# Altium project ARTIX.PrjPcb
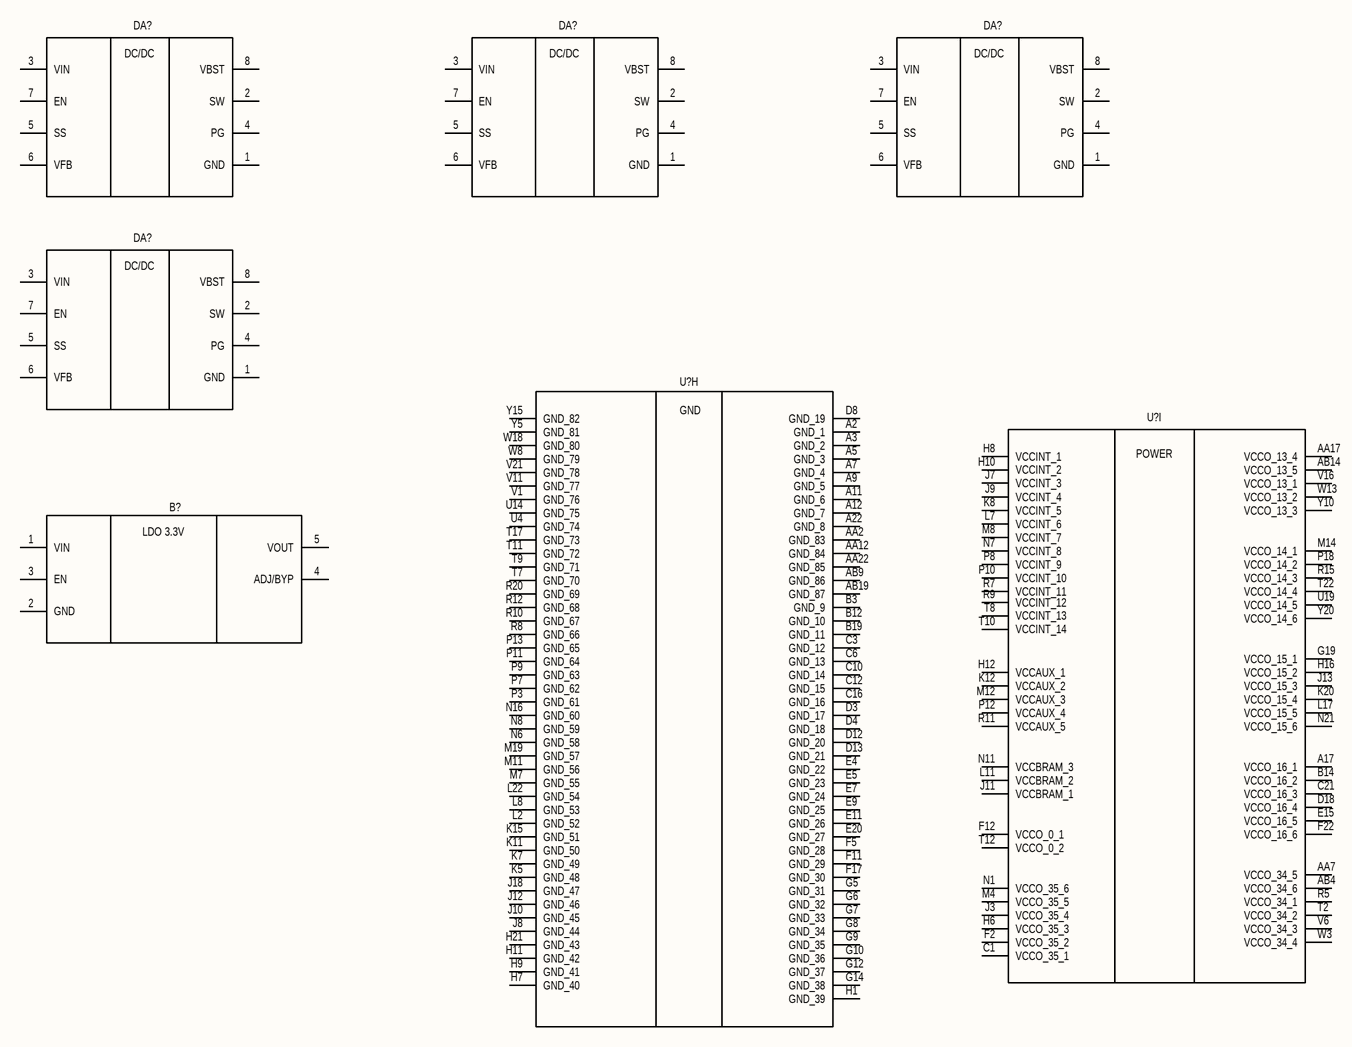
[diagram p0: 01_Power.SchDoc]
6 sheets, 41 parts. Net scope: global (net labels, ports and power ports of the same name join across sheets).
Sheets:
  01_Power.SchDoc
  02_FPGA_IO_Config.SchDoc
  03_FPGA_IO_Clock.SchDoc
  04_Reference_Inputs.SchDoc
  05_PPS_Outputs.SchDoc
  06_Ethernet.SchDoc

## Sheet 01_Power.SchDoc: Наименование
size 420 x 297 mm; Name: Наименование; ApprovedBy: Сергеева А.А.; CheckedBy: Рогозин А.А.; Author: Кузнецов М.Д.; CompanyName: МГТУ им. Баумана; DocumentNumber: 2; SheetNumber: 1; SheetTotal: 6; PageSetup: Record=PageOptions|CenterHorizontal=True|CenterVertical=True|PrintScale=0.94|XCorrection=1.00|YCorrection=1.00|PrintKind=1|BorderSize=5000000|LeftOffset=0|BottomOffset=0|Orientation=1|PaperLength=1000|PaperWidth=1000|Scale=100|PaperSource=7|PrintQuality=-4|MediaType=1|DitherType=10|PaperKind=A4|PrintScaleMode=1; DecimalNumber: МГТУ.468784.001; HeadOfSector: Нач. сектора; MainDevice: Перв.примен.; Name1: Плата расширения; n_kontr: Н. Контр; t_kontr: Т. Контр; lit_A: О; Name2: для отладочного модуля; DocumentName: Sheet1.SCHDOC

### Parts
(Parts that share a designator on the sheet are numbered #1, #2 ... from top to bottom, then left to right.)
B?#1  SPX3819M5-L-3-3  [SOT95P280X145-5N]  (value not drawn)
DA?#1  TPS563210A  [SOT65P280X110-8N]  (value not drawn)
DA?#2  TPS563210A  [SOT65P280X110-8N]  (value not drawn)
DA?#3  TPS563210A  [SOT65P280X110-8N]  (value not drawn)
DA?#4  TPS563210A  [SOT65P280X110-8N]  (value not drawn)
U?#1  XC7A50T-2FGG484I  [BGA484C100P22X22_2300X2300X260]  (value not drawn)  (part H of 10)
U?#2  XC7A50T-2FGG484I  [BGA484C100P22X22_2300X2300X260]  (value not drawn)  (part I of 10)

### Nets

Not connected (* = marked no-connect by the designer): B?#1 1(VIN) 2(GND) 3(EN) 4(ADJ/BYP) 5(VOUT); DA?#1 1(GND) 2(SW) 3(VIN) 4(PG) 5(SS) 6(VFB) 7(EN) 8(VBST); DA?#2 1(GND) 2(SW) 3(VIN) 4(PG) 5(SS) 6(VFB) 7(EN) 8(VBST); DA?#3 1(GND) 2(SW) 3(VIN) 4(PG) 5(SS) 6(VFB) 7(EN) 8(VBST); DA?#4 1(GND) 2(SW) 3(VIN) 4(PG) 5(SS) 6(VFB) 7(EN) 8(VBST); U?#1 A2(GND_1) A3(GND_2) A5(GND_3) A7(GND_4) A9(GND_5) A11(GND_6) A12(GND_7) A22(GND_8) AA2(GND_83) AA12(GND_84) AA22(GND_85) AB9(GND_86) AB19(GND_87) B3(GND_9) B12(GND_10) B19(GND_11) C3(GND_12) C6(GND_13) C10(GND_14) C12(GND_15) C16(GND_16) D3(GND_17) D4(GND_18) D8(GND_19) D12(GND_20) D13(GND_21) E4(GND_22) E5(GND_23) E7(GND_24) E9(GND_25) E11(GND_26) E20(GND_27) F5(GND_28) F11(GND_29) F17(GND_30) G5(GND_31) G6(GND_32) G7(GND_33) G8(GND_34) G9(GND_35) G10(GND_36) G12(GND_37) G14(GND_38) H1(GND_39) H7(GND_40) H9(GND_41) H11(GND_42) H21(GND_43) J8(GND_44) J10(GND_45) J12(GND_46) J18(GND_47) K5(GND_48) K7(GND_49) K11(GND_50) K15(GND_51) L2(GND_52) L8(GND_53) L22(GND_54) M7(GND_55) M11(GND_56) M19(GND_57) N6(GND_58) N8(GND_59) N16(GND_60) P3(GND_61) P7(GND_62) P9(GND_63) P11(GND_64) P13(GND_65) R8(GND_66) R10(GND_67) R12(GND_68) R20(GND_69) T7(GND_70) T9(GND_71) T11(GND_72) T17(GND_73) U4(GND_74) U14(GND_75) V1(GND_76) V11(GND_77) V21(GND_78) W8(GND_79) W18(GND_80) Y5(GND_81) Y15(GND_82); U?#2 A17(VCCO_16_1) AA7(VCCO_34_5) AA17(VCCO_13_4) AB4(VCCO_34_6) AB14(VCCO_13_5) B14(VCCO_16_2) C1(VCCO_35_1) C21(VCCO_16_3) D18(VCCO_16_4) E15(VCCO_16_5) F2(VCCO_35_2) F12(VCCO_0_1) F22(VCCO_16_6) G19(VCCO_15_1) H6(VCCO_35_3) H8(VCCINT_1) H10(VCCINT_2) H12(VCCAUX_1) H16(VCCO_15_2) J3(VCCO_35_4) J7(VCCINT_3) J9(VCCINT_4) J11(VCCBRAM_1) J13(VCCO_15_3) K8(VCCINT_5) K12(VCCAUX_2) K20(VCCO_15_4) L7(VCCINT_6) L11(VCCBRAM_2) L17(VCCO_15_5) M4(VCCO_35_5) M8(VCCINT_7) M12(VCCAUX_3) M14(VCCO_14_1) N1(VCCO_35_6) N7(VCCINT_8) N11(VCCBRAM_3) N21(VCCO_15_6) P8(VCCINT_9) P10(VCCINT_10) P12(VCCAUX_4) P18(VCCO_14_2) R5(VCCO_34_1) R7(VCCINT_11) R9(VCCINT_12) R11(VCCAUX_5) R15(VCCO_14_3) T2(VCCO_34_2) T8(VCCINT_13) T10(VCCINT_14) T12(VCCO_0_2) T22(VCCO_14_4) U19(VCCO_14_5) V6(VCCO_34_3) V16(VCCO_13_1) W3(VCCO_34_4) W13(VCCO_13_2) Y10(VCCO_13_3) Y20(VCCO_14_6)

### Notes on the sheet
- Перв.примен.
- Справ.№
- Подп. и дата
- Инв.№ дубл.
- Взам.инв.№
- Подп.и дата
- Разраб.
- Изм.
- Лист
- № докум.
- Подп.
- Дата
- Лит.
- Масштаб
- Масса
- Т.контр.
- Пров.
- СХЕМА   ЭЛЕКТРИЧЕСКАЯ
- ПРИНЦИПИАЛЬНАЯ
- Листов
- Инв.№ подл.
- Утв.
- Н.контр.
- Нач.сект.
- Формат  A3
- (in symbol SPX3819M5-L-3-3) LDO 3.3V
- (in symbol TPS563210A) DC/DC
- (in symbol XC7A50T-2FGG484I, part H) GND
- (in symbol XC7A50T-2FGG484I, part I) POWER

### Library data of the parts
B?#1 = SPX3819M5-L-3-3: IC REG LINEAR 3.3V 500MA SOT23-5; Manufacturer_Name: MaxLinear, Inc.; Geometry.Height: 1.45mm; Manufacturer_Part_Number: SPX3819M5-L-3-3; Mouser Part Number: 701-SPX3819M5-L-3-3; Mouser Price/Stock: https://www.mouser.co.uk/ProductDetail/MaxLinear/SPX3819M5-L-3-3?qs=2Z08r0Wtf%2Fyl32mFDRYBCg%3D%3D; Arrow Part Number: *; Arrow Price/Stock: *; Datasheet Link: https://componentsearchengine.com/Datasheets/2/SPX3819M5-L-3-3.pdf
DA?#1-DA?#4 = TPS563210A: Texas Instruments TPS563210A synchronous buck regulator, DDF 8-pin; custom GOST-style schematic symbol; OrderingSuffix: DDFR/DDFT packaging not selected; Manufacturer: Texas Instruments; MPN: TPS563210A; Package: DDF; Datasheet: https://www.ti.com/lit/ds/symlink/tps563210a.pdf; Source: TI datasheet pin functions page 3; user-requested native symbol
U?#1 U?#2 = XC7A50T-2FGG484I: FPGA - Field Programmable Gate Array XC7A50T-2FGG484I; Manufacturer_Name: AMD; Geometry.Height: 2.6mm; Manufacturer_Part_Number: XC7A50T-2FGG484I; Mouser Part Number: 217-XC7A50T-2FGG484I; Mouser Price/Stock: https://www.mouser.co.uk/ProductDetail/Xilinx/XC7A50T-2FGG484I?qs=rrS6PyfT74djoRso%252BOe%2F9Q%3D%3D; Arrow Part Number: *; Arrow Price/Stock: *; Datasheet Link: https://www.xilinx.com/support/documentation/data_sheets/ds181_Artix_7_Data_Sheet.pdf

## Sheet 02_FPGA_IO_Config.SchDoc: Наименование
size 420 x 297 mm; Name: Наименование; ApprovedBy: Сергеева А.А.; CheckedBy: Рогозин А.А.; Author: Кузнецов М.Д.; CompanyName: МГТУ им. Баумана; DocumentNumber: 3; SheetNumber: 2; SheetTotal: 6; PageSetup: Record=PageOptions|CenterHorizontal=True|CenterVertical=True|PrintScale=0.94|XCorrection=1.00|YCorrection=1.00|PrintKind=1|BorderSize=5000000|LeftOffset=0|BottomOffset=0|Orientation=1|PaperLength=1000|PaperWidth=1000|Scale=100|PaperSource=7|PrintQuality=-4|MediaType=1|DitherType=10|PaperKind=A4|PrintScaleMode=1; DecimalNumber: МГТУ.468784.001; HeadOfSector: Нач. сектора; MainDevice: Перв.примен.; Name1: Плата расширения; n_kontr: Н. Контр; t_kontr: Т. Контр; lit_A: О; Name2: для отладочного модуля; DocumentName: Sheet1.SCHDOC
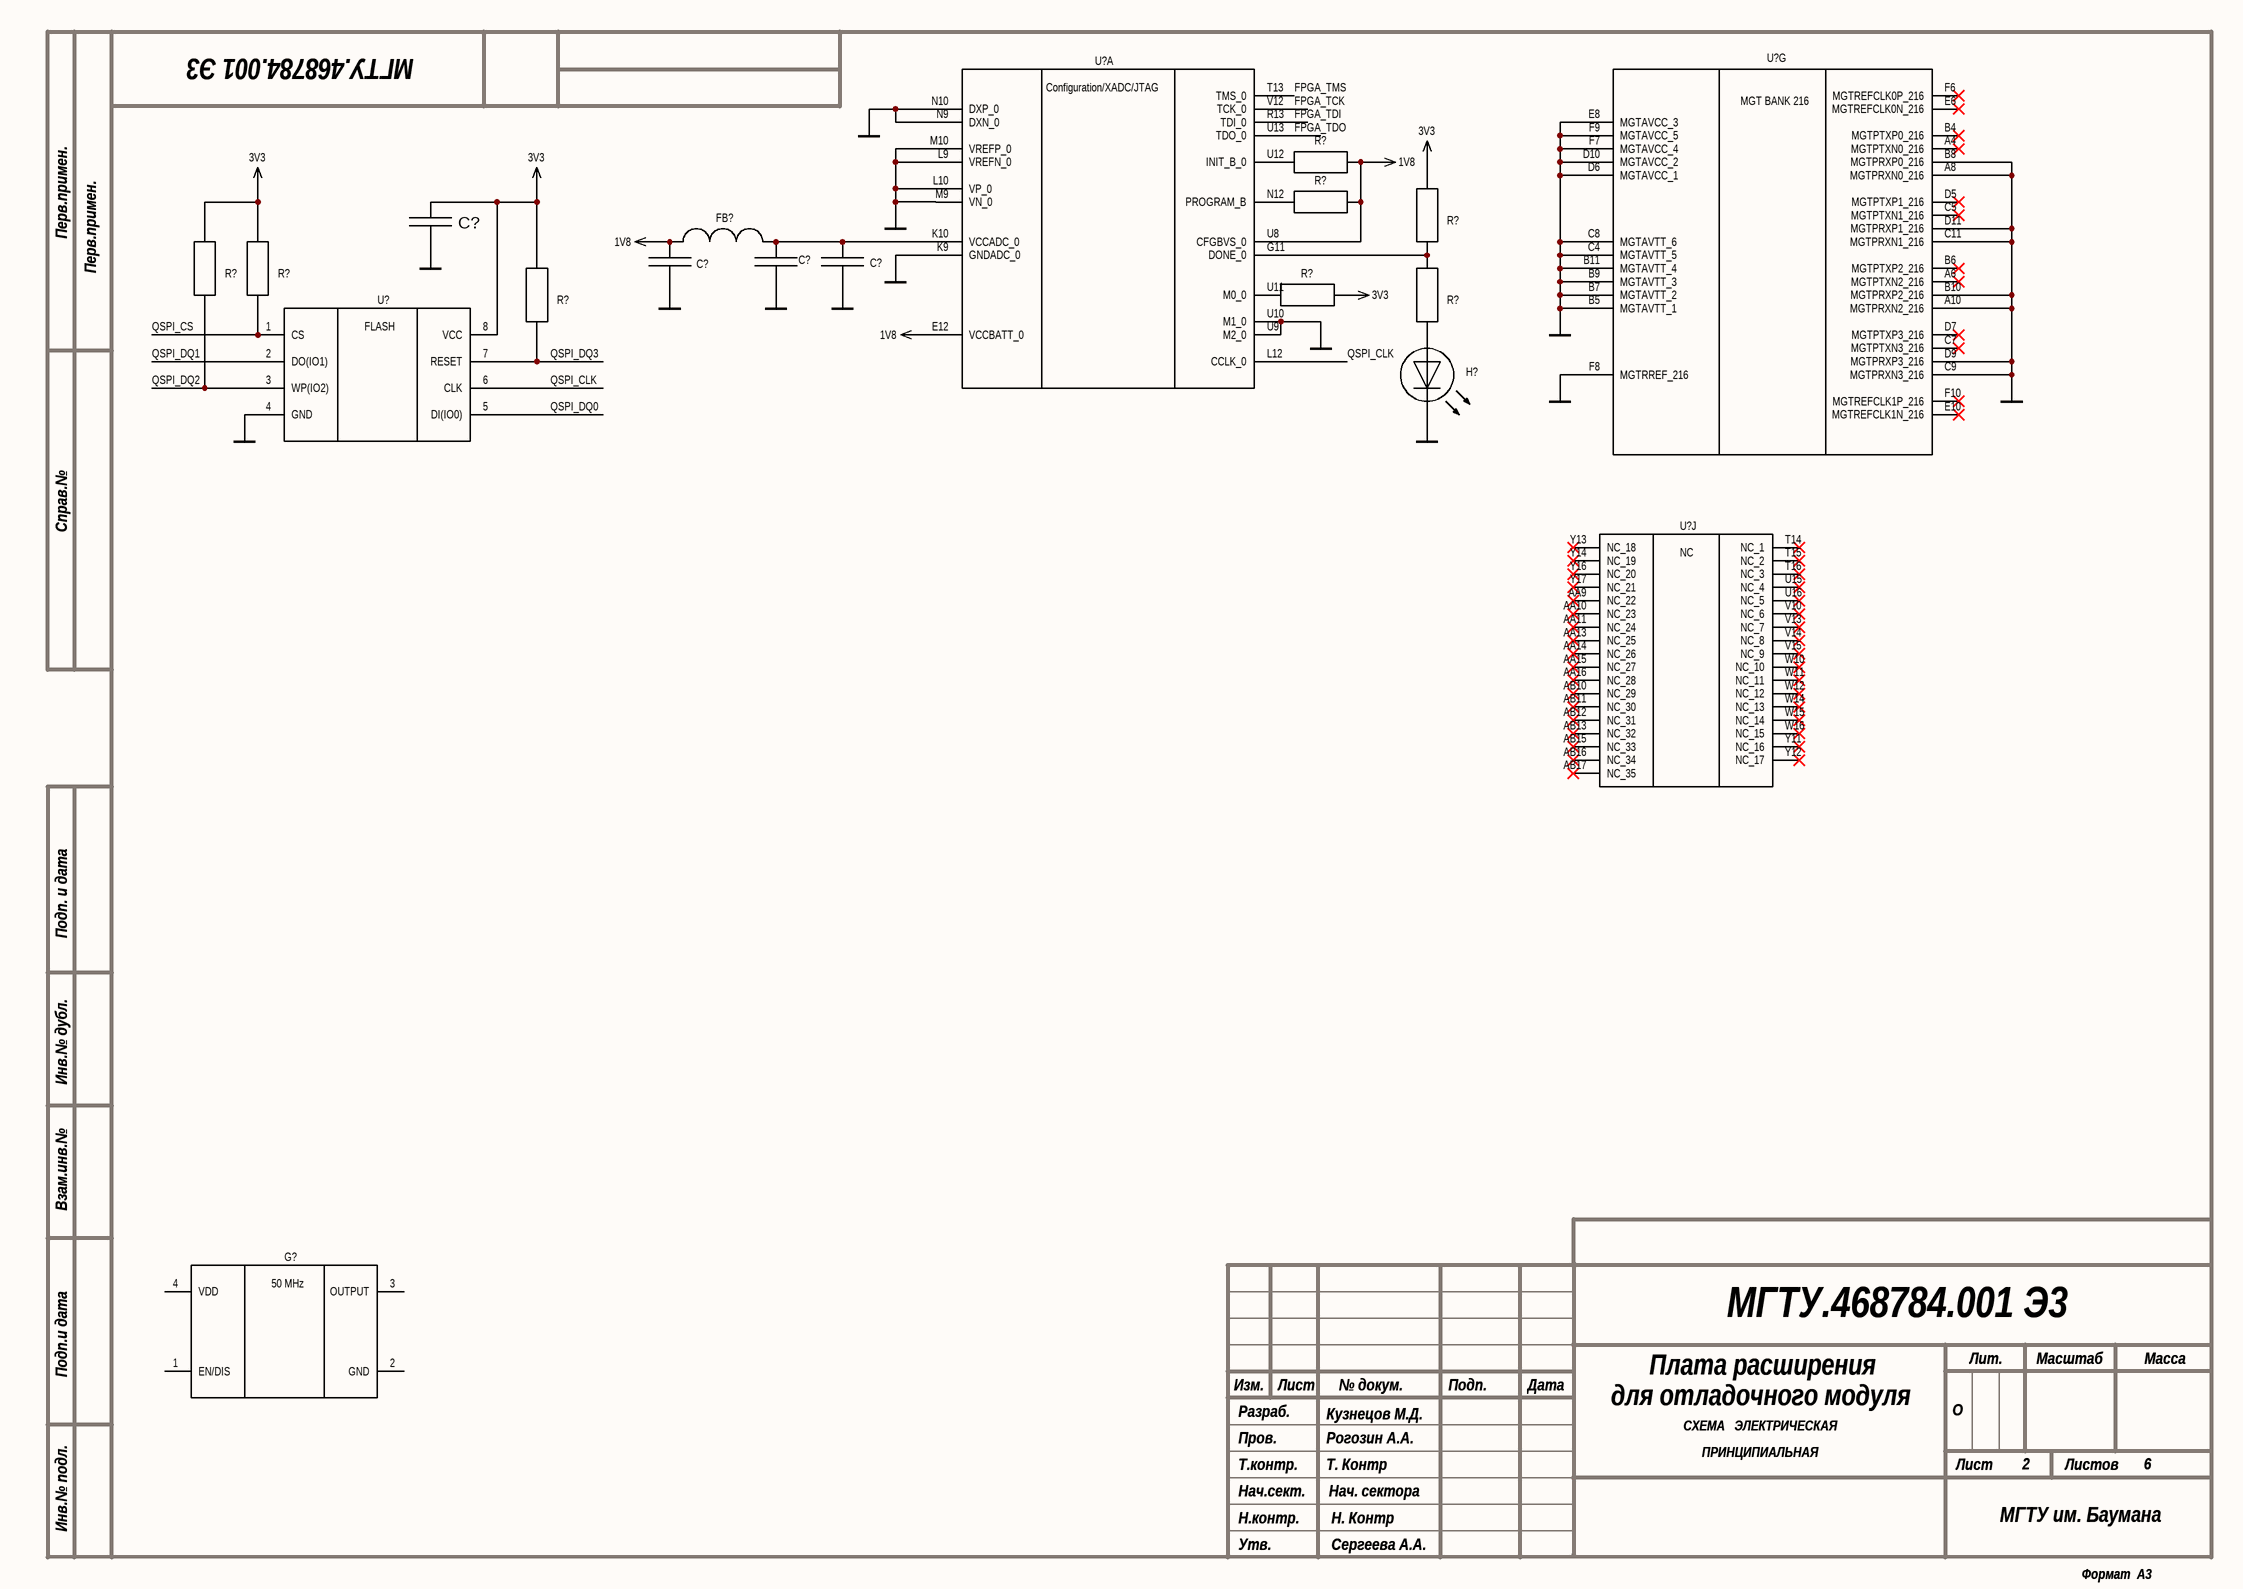
[diagram p1: 02_FPGA_IO_Config.SchDoc]

### Parts
(Parts that share a designator on the sheet are numbered #1, #2 ... from top to bottom, then left to right.)
C?#1  C  [C_0603]  (value not drawn)
C?#2  C  [C_1206]  (value not drawn)
C?#3  C  [C_0805]  (value not drawn)
C?#4  C  [C_0603]  (value not drawn)
FB?  BLM18SG121TN1D  [FP-BLM18-0_15-t0_5-d1_2-IPC_B]  (value not drawn)
G?#1  ASV-50.000MHZ-LRS-T  [ASV25000MHZEJT]  (value not drawn)
H?  LED  [PLCC2]  (value not drawn)
R?#1  R  [R_1206]  (value not drawn)
R?#2  R  [R_1206]  (value not drawn)
R?#3  R  [R_1206]  (value not drawn)
R?#4  R  [R_1206]  (value not drawn)
R?#5  R  [R_1206]  (value not drawn)
R?#6  R  [R_0603]  (value not drawn)
R?#7  R  [R_0603]  (value not drawn)
R?#8  R  [R_0603]  (value not drawn)
U?#3  XC7A50T-2FGG484I  [BGA484C100P22X22_2300X2300X260]  (value not drawn)  (part A of 10)
U?#4  XC7A50T-2FGG484I  [BGA484C100P22X22_2300X2300X260]  (value not drawn)  (part G of 10)
U?#5  W25Q128JVSIQ  [SOIC127P790X216-8N]  (value not drawn)
U?#6  XC7A50T-2FGG484I  [BGA484C100P22X22_2300X2300X260]  (value not drawn)  (part J of 10)

### Nets
1V8: C?#3.2 FB?.1 R?#1.2 R?#2.2 U?#3.E12(VCCBATT_0) U?#3.U8(CFGBVS_0)
3V3: C?#1.2 R?#3.1 R?#4.1 R?#5.1 R?#6.2 R?#7.2 U?#5.8(VCC)
GND: C?#1.1 C?#2.2 C?#3.1 C?#4.1 H?.2(C) U?#3.K9(GNDADC_0) U?#3.L9(VREFN_0) U?#3.L10(VP_0) U?#3.M9(VN_0) U?#3.M10(VREFP_0) U?#3.N9(DXN_0) U?#3.N10(DXP_0) U?#3.U9(M2_0) U?#3.U10(M1_0) U?#4.A8(MGTPRXN0_216) U?#4.A10(MGTPRXN2_216) U?#4.B5(MGTAVTT_1) U?#4.B7(MGTAVTT_2) U?#4.B8(MGTPRXP0_216) U?#4.B9(MGTAVTT_3) U?#4.B10(MGTPRXP2_216) U?#4.B11(MGTAVTT_4) U?#4.C4(MGTAVTT_5) U?#4.C8(MGTAVTT_6) U?#4.C9(MGTPRXN3_216) U?#4.C11(MGTPRXN1_216) U?#4.D6(MGTAVCC_1) U?#4.D9(MGTPRXP3_216) U?#4.D10(MGTAVCC_2) U?#4.D11(MGTPRXP1_216) U?#4.E8(MGTAVCC_3) U?#4.F7(MGTAVCC_4) U?#4.F8(MGTRREF_216) U?#4.F9(MGTAVCC_5) U?#5.4(GND)
FPGA_TCK: U?#3.V12(TCK_0)
FPGA_TDI: U?#3.R13(TDI_0)
FPGA_TDO: U?#3.U13(TDO_0)
FPGA_TMS: U?#3.T13(TMS_0)
QSPI_CLK: U?#3.L12(CCLK_0) U?#5.6(CLK)
QSPI_CS: R?#4.2 U?#5.1(CS)
QSPI_DQ0: U?#5.5(DI(IO0))
QSPI_DQ1: U?#5.2(DO(IO1))
QSPI_DQ2: R?#3.2 U?#5.3(WP(IO2))
QSPI_DQ3: R?#5.2 U?#5.7(RESET)
NetC?#2_1: C?#2.1 C?#4.2 FB?.2 U?#3.K10(VCCADC_0)
NetH?_1: H?.1(A) R?#8.1
NetR?#1_1: R?#1.1 U?#3.U12(INIT_B_0)
NetR?#2_1: R?#2.1 U?#3.N12(PROGRAM_B)
NetR?#6_1: R?#6.1 R?#8.2 U?#3.G11(DONE_0)
NetR?#7_1: R?#7.1 U?#3.U11(M0_0)

Not connected (* = marked no-connect by the designer): G?#1 1(EN/DIS) 2(GND) 3(OUTPUT) 4(VDD); U?#4 A4(MGTPTXN0_216)* A6(MGTPTXN2_216)* B4(MGTPTXP0_216)* B6(MGTPTXP2_216)* C5(MGTPTXN1_216)* C7(MGTPTXN3_216)* D5(MGTPTXP1_216)* D7(MGTPTXP3_216)* E6(MGTREFCLK0N_216)* E10(MGTREFCLK1N_216)* F6(MGTREFCLK0P_216)* F10(MGTREFCLK1P_216)*; U?#6 AA9(NC_22)* AA10(NC_23)* AA11(NC_24)* AA13(NC_25)* AA14(NC_26)* AA15(NC_27)* AA16(NC_28)* AB10(NC_29)* AB11(NC_30)* AB12(NC_31)* AB13(NC_32)* AB15(NC_33)* AB16(NC_34)* AB17(NC_35)* T14(NC_1)* T15(NC_2)* T16(NC_3)* U15(NC_4)* U16(NC_5)* V10(NC_6)* V13(NC_7)* V14(NC_8)* V15(NC_9)* W10(NC_10)* W11(NC_11)* W12(NC_12)* W14(NC_13)* W15(NC_14)* W16(NC_15)* Y11(NC_16)* Y12(NC_17)* Y13(NC_18)* Y14(NC_19)* Y16(NC_20)* Y17(NC_21)*

### Notes on the sheet
- Перв.примен.
- Справ.№
- Подп. и дата
- Инв.№ дубл.
- Взам.инв.№
- Подп.и дата
- Разраб.
- Изм.
- Лист
- № докум.
- Подп.
- Дата
- Лит.
- Масштаб
- Масса
- Т.контр.
- Пров.
- СХЕМА   ЭЛЕКТРИЧЕСКАЯ
- ПРИНЦИПИАЛЬНАЯ
- Листов
- Инв.№ подл.
- Утв.
- Н.контр.
- Нач.сект.
- Формат  A3
- (in symbol ASV-50.000MHZ-LRS-T) 50 MHz
- (in symbol W25Q128JVSIQ) FLASH
- (in symbol XC7A50T-2FGG484I, part A) Configuration/XADC/JTAG
- (in symbol XC7A50T-2FGG484I, part G) MGT BANK 216
- (in symbol XC7A50T-2FGG484I, part J) NC

### Library data of the parts
C?#1 C?#4 = Конденсатор GRM188R71C104K (0.10 мкФ +-10% X7R 16В): Capacitance: 0u1; Tolerance: ±10%; Dielectric Type: X7R; Maximum Voltage: 16V; Part Number: Конденсатор GRM188R71C104K (0.10 мкФ +-10% X7R 16В); HelpURL: http://search.murata.co.jp/Ceramy/image/img/A01X/G101/ENG/GRM188R71C104KA01-01.pdf
C?#2 = Конденсатор GRM31CR71H475K (4.7 мкФ +-10% X7R 50В): Capacitance: 4u7; Tolerance: ±10%; Dielectric Type: X7R; Maximum Voltage: 50V; Part Number: Конденсатор GRM31CR71H475K (4.7 мкФ +-10% X7R 50В); HelpURL: http://search.murata.co.jp/Ceramy/image/img/A01X/G101/ENG/GRM31CR71H475KA12-01.pdf
C?#3 = Конденсатор GRM21BR71C105K (1.0 мкФ +-10% X7R 16В): Capacitance: 1u; Tolerance: ±10%; Dielectric Type: X7R; Maximum Voltage: 16V; Part Number: Конденсатор GRM21BR71C105K (1.0 мкФ +-10% X7R 16В); HelpURL: http://search.murata.co.jp/Ceramy/image/img/A01X/G101/ENG/GRM21BR71C105KA01-01.pdf
FB? = CMP-0686-00602-4: Chip Ferrite Bead, 0603, 120Ω @ 100MHz, 25%, 0.025Ω, 3A; DC Resistance (DCR): 25mR; Shielding: Unshielded; Material: Steel; Number of Circuits: 1; Impedance: 120R; Tolerance: 25%; REACH SVHC: No SVHC; Case/Package: 0603; Max DC Current: 3A; Core Material: Ferrite; Case Code (Metric): 1608; Frequency: 100MHz; Package Quantity: 1; Height: 0.8mm; Lead Free: Lead Free; Test Frequency: 100MHz; RoHS Compliant: Yes; DC Resistance-Max: 25mR; Min Operating Temperature: -55°C; Width: 0.8mm; Termination: SMD/SMT; Length: 1.6mm; Max Current Rating: 3A; Number of Lines: 1; Series: BLM18S; Number of Pins: 2; Packaging: Tape and Reel; Current Rating: 3A; Depth: 0.8mm; Case Code (Imperial): 0603; Max Operating Temperature: 125°C
G?#1 = ASV-50.000MHZ-LRS-T: Crystal or Oscillator; Manufacturer_Name: ABRACON; Datasheet Link: https://abracon.com/Oscillators/ASV.pdf; Height: 1.8mm; Manufacturer_Part_Number: ASV-50.000MHZ-LRS-T; Mouser Part Number: 815-ASV50000MHZLRST; Mouser Price/Stock: https://www.mouser.co.uk/ProductDetail/ABRACON/ASV-50.000MHZ-LRS-T?qs=vmHwEFxEFR%252BcE99Zr2GZkQ%3D%3D
H? = Светодиод CLM1B-RKW: Part Number: Светодиод CLM1B-RKW; HelpURL: http://www.cree.com/~/media/Files/Cree/LED-Components-and-Modules/HB/Data-Sheets/CLM1BRKWAKW1084.pdf; Color: Red
R?#1-R?#5 = Резистор RC1206JR-074K7L (4.7 кОм +-5%): Resistance: 4k7; Tolerance: ±5%; Power: 0.25 W; Maximum Working Voltage: 200V; Maximum Overload Voltage: 400V; Part Number: Резистор RC1206JR-074K7L (4.7 кОм +-5%); HelpURL: http://www.yageo.ru/pdf/RC1206.pdf
R?#6 R?#8 = Резистор RC0603JR-07240RL (240 Ом +-5%): Resistance: 240; Tolerance: ±5%; Power: 0.1 W; Maximum Working Voltage: 50V; Maximum Overload Voltage: 100V; Part Number: Резистор RC0603JR-07240RL (240 Ом +-5%); HelpURL: http://www.yageo.ru/pdf/RC0603.pdf
R?#7 = Резистор RC0603JR-0711KL (11 кОм +-5%): Resistance: 11k; Tolerance: ±5%; Power: 0.1 W; Maximum Working Voltage: 50V; Maximum Overload Voltage: 100V; Part Number: Резистор RC0603JR-0711KL (11 кОм +-5%); HelpURL: http://www.yageo.ru/pdf/RC0603.pdf
U?#3 U?#4 U?#6 = XC7A50T-2FGG484I: as U?#1 on sheet 01_Power; Manufacturer_Part_Number: XC7A50T-2FGG484I; Mouser Part Number: 217-XC7A50T-2FGG484I; Mouser Price/Stock: https://www.mouser.co.uk/ProductDetail/Xilinx/XC7A50T-2FGG484I?qs=rrS6PyfT74djoRso%252BOe%2F9Q%3D%3D; Arrow Part Number: *; Arrow Price/Stock: *; Datasheet Link: https://www.xilinx.com/support/documentation/data_sheets/ds181_Artix_7_Data_Sheet.pdf
U?#5 = W25Q128JVSIQ: FLASH - NOR Memory IC 128Mb (16M x 8) SPI - Quad I/O, QPI, DTR 133 MHz 8-SOIC; MF: Winbond Electronics; SnapEDA_Link: https://www.snapeda.com/parts/W25Q128JVSIQ/Winbond/view-part/?ref=snap; Package: SOIC-8 Winbond Electronics; Value: *; MP: W25Q128JVSIQ; Check_prices: https://www.snapeda.com/parts/W25Q128JVSIQ/Winbond/view-part/?ref=eda

## Sheet 03_FPGA_IO_Clock.SchDoc: Наименование
size 420 x 297 mm; Name: Наименование; ApprovedBy: Сергеева А.А.; CheckedBy: Рогозин А.А.; Author: Кузнецов М.Д.; CompanyName: МГТУ им. Баумана; DocumentNumber: 4; SheetNumber: 3; SheetTotal: 6; PageSetup: Record=PageOptions|CenterHorizontal=True|CenterVertical=True|PrintScale=0.94|XCorrection=1.00|YCorrection=1.00|PrintKind=1|BorderSize=5000000|LeftOffset=0|BottomOffset=0|Orientation=1|PaperLength=1000|PaperWidth=1000|Scale=100|PaperSource=7|PrintQuality=-4|MediaType=1|DitherType=10|PaperKind=A4|PrintScaleMode=1; DecimalNumber: МГТУ.468784.001; HeadOfSector: Нач. сектора; MainDevice: Перв.примен.; Name1: Плата расширения; n_kontr: Н. Контр; t_kontr: Т. Контр; lit_A: О; Name2: для отладочного модуля; DocumentName: Sheet1.SCHDOC
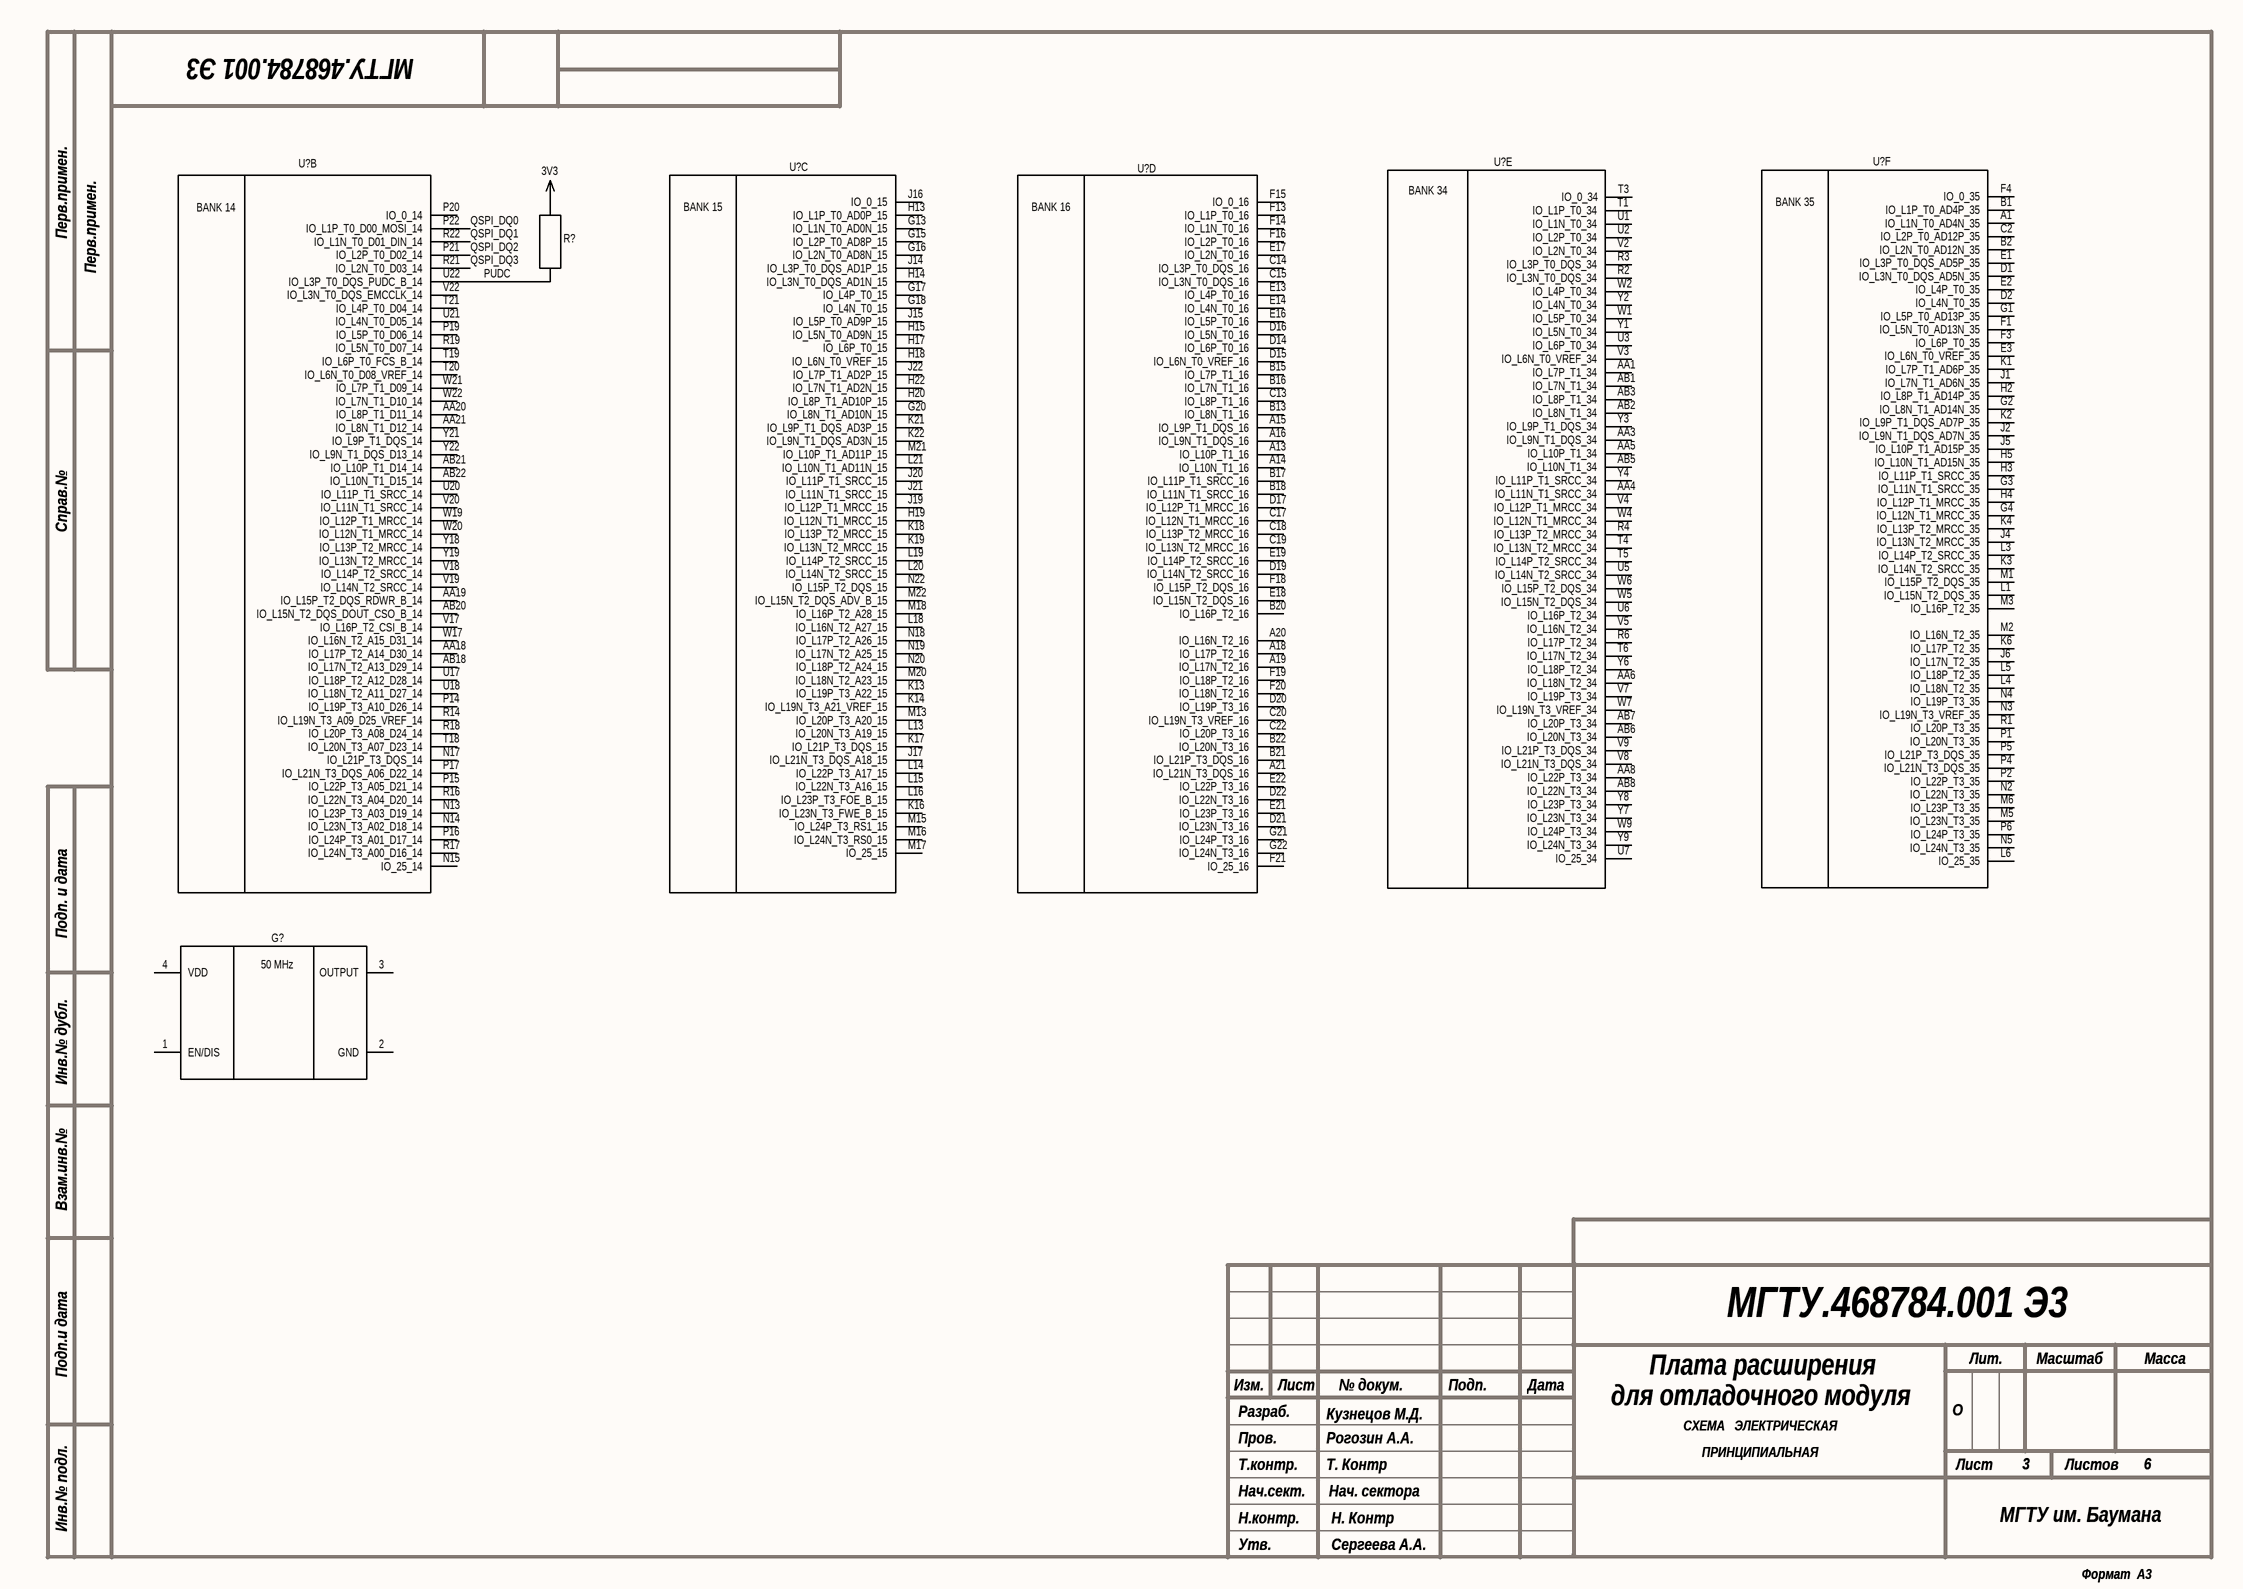
[diagram p2: 03_FPGA_IO_Clock.SchDoc]

### Parts
(Parts that share a designator on the sheet are numbered #1, #2 ... from top to bottom, then left to right.)
G?#2  ASV-50.000MHZ-LRS-T  [ASV2550000MHZEJT]  (value not drawn)
R?#9  R  [R_0805]  (value not drawn)
U?#7  XC7A50T-2FGG484I  [BGA484C100P22X22_2300X2300X260]  (value not drawn)  (part E of 10)
U?#8  XC7A50T-2FGG484I  [BGA484C100P22X22_2300X2300X260]  (value not drawn)  (part F of 10)
U?#9  XC7A50T-2FGG484I  [BGA484C100P22X22_2300X2300X260]  (value not drawn)  (part B of 10)
U?#10  XC7A50T-2FGG484I  [BGA484C100P22X22_2300X2300X260]  (value not drawn)  (part C of 10)
U?#11  XC7A50T-2FGG484I  [BGA484C100P22X22_2300X2300X260]  (value not drawn)  (part D of 10)

### Nets
3V3: R?#9.2
PUDC: R?#9.1 U?#9.U22(IO_L3P_T0_DQS_PUDC_B_14)
QSPI_DQ0: U?#9.P22(IO_L1P_T0_D00_MOSI_14)
QSPI_DQ1: U?#9.R22(IO_L1N_T0_D01_DIN_14)
QSPI_DQ2: U?#9.P21(IO_L2P_T0_D02_14)
QSPI_DQ3: U?#9.R21(IO_L2N_T0_D03_14)

Not connected (* = marked no-connect by the designer): G?#2 1(EN/DIS) 2(GND) 3(OUTPUT) 4(VDD); U?#7 AA1(IO_L7P_T1_34) AA3(IO_L9N_T1_DQS_34) AA4(IO_L11N_T1_SRCC_34) AA5(IO_L10P_T1_34) AA6(IO_L18N_T2_34) AA8(IO_L22P_T3_34) AB1(IO_L7N_T1_34) AB2(IO_L8N_T1_34) AB3(IO_L8P_T1_34) AB5(IO_L10N_T1_34) AB6(IO_L20N_T3_34) AB7(IO_L20P_T3_34) AB8(IO_L22N_T3_34) R2(IO_L3N_T0_DQS_34) R3(IO_L3P_T0_DQS_34) R4(IO_L13P_T2_MRCC_34) R6(IO_L17P_T2_34) T1(IO_L1P_T0_34) T3(IO_0_34) T4(IO_L13N_T2_MRCC_34) T5(IO_L14P_T2_SRCC_34) T6(IO_L17N_T2_34) U1(IO_L1N_T0_34) U2(IO_L2P_T0_34) U3(IO_L6P_T0_34) U5(IO_L14N_T2_SRCC_34) U6(IO_L16P_T2_34) U7(IO_25_34) V2(IO_L2N_T0_34) V3(IO_L6N_T0_VREF_34) V4(IO_L12P_T1_MRCC_34) V5(IO_L16N_T2_34) V7(IO_L19P_T3_34) V8(IO_L21N_T3_DQS_34) V9(IO_L21P_T3_DQS_34) W1(IO_L5P_T0_34) W2(IO_L4P_T0_34) W4(IO_L12N_T1_MRCC_34) W5(IO_L15N_T2_DQS_34) W6(IO_L15P_T2_DQS_34) W7(IO_L19N_T3_VREF_34) W9(IO_L24P_T3_34) Y1(IO_L5N_T0_34) Y2(IO_L4N_T0_34) Y3(IO_L9P_T1_DQS_34) Y4(IO_L11P_T1_SRCC_34) Y6(IO_L18P_T2_34) Y7(IO_L23N_T3_34) Y8(IO_L23P_T3_34) Y9(IO_L24N_T3_34); U?#8 A1(IO_L1N_T0_AD4N_35) B1(IO_L1P_T0_AD4P_35) B2(IO_L2N_T0_AD12N_35) C2(IO_L2P_T0_AD12P_35) D1(IO_L3N_T0_DQS_AD5N_35) D2(IO_L4N_T0_35) E1(IO_L3P_T0_DQS_AD5P_35) E2(IO_L4P_T0_35) E3(IO_L6N_T0_VREF_35) F1(IO_L5N_T0_AD13N_35) F3(IO_L6P_T0_35) F4(IO_0_35) G1(IO_L5P_T0_AD13P_35) G2(IO_L8N_T1_AD14N_35) G3(IO_L11N_T1_SRCC_35) G4(IO_L12N_T1_MRCC_35) H2(IO_L8P_T1_AD14P_35) H3(IO_L11P_T1_SRCC_35) H4(IO_L12P_T1_MRCC_35) H5(IO_L10N_T1_AD15N_35) J1(IO_L7N_T1_AD6N_35) J2(IO_L9N_T1_DQS_AD7N_35) J4(IO_L13N_T2_MRCC_35) J5(IO_L10P_T1_AD15P_35) J6(IO_L17N_T2_35) K1(IO_L7P_T1_AD6P_35) K2(IO_L9P_T1_DQS_AD7P_35) K3(IO_L14N_T2_SRCC_35) K4(IO_L13P_T2_MRCC_35) K6(IO_L17P_T2_35) L1(IO_L15N_T2_DQS_35) L3(IO_L14P_T2_SRCC_35) L4(IO_L18N_T2_35) L5(IO_L18P_T2_35) L6(IO_25_35) M1(IO_L15P_T2_DQS_35) M2(IO_L16N_T2_35) M3(IO_L16P_T2_35) M5(IO_L23N_T3_35) M6(IO_L23P_T3_35) N2(IO_L22N_T3_35) N3(IO_L19N_T3_VREF_35) N4(IO_L19P_T3_35) N5(IO_L24N_T3_35) P1(IO_L20N_T3_35) P2(IO_L22P_T3_35) P4(IO_L21N_T3_DQS_35) P5(IO_L21P_T3_DQS_35) P6(IO_L24P_T3_35) R1(IO_L20P_T3_35); U?#9 AA18(IO_L17P_T2_A14_D30_14) AA19(IO_L15P_T2_DQS_RDWR_B_14) AA20(IO_L8P_T1_D11_14) AA21(IO_L8N_T1_D12_14) AB18(IO_L17N_T2_A13_D29_14) AB20(IO_L15N_T2_DQS_DOUT_CSO_B_14) AB21(IO_L10P_T1_D14_14) AB22(IO_L10N_T1_D15_14) N13(IO_L23P_T3_A03_D19_14) N14(IO_L23N_T3_A02_D18_14) N15(IO_25_14) N17(IO_L21P_T3_DQS_14) P14(IO_L19P_T3_A10_D26_14) P15(IO_L22P_T3_A05_D21_14) P16(IO_L24P_T3_A01_D17_14) P17(IO_L21N_T3_DQS_A06_D22_14) P19(IO_L5P_T0_D06_14) P20(IO_0_14) R14(IO_L19N_T3_A09_D25_VREF_14) R16(IO_L22N_T3_A04_D20_14) R17(IO_L24N_T3_A00_D16_14) R18(IO_L20P_T3_A08_D24_14) R19(IO_L5N_T0_D07_14) T18(IO_L20N_T3_A07_D23_14) T19(IO_L6P_T0_FCS_B_14) T20(IO_L6N_T0_D08_VREF_14) T21(IO_L4P_T0_D04_14) U17(IO_L18P_T2_A12_D28_14) U18(IO_L18N_T2_A11_D27_14) U20(IO_L11P_T1_SRCC_14) U21(IO_L4N_T0_D05_14) V17(IO_L16P_T2_CSI_B_14) V18(IO_L14P_T2_SRCC_14) V19(IO_L14N_T2_SRCC_14) V20(IO_L11N_T1_SRCC_14) V22(IO_L3N_T0_DQS_EMCCLK_14) W17(IO_L16N_T2_A15_D31_14) W19(IO_L12P_T1_MRCC_14) W20(IO_L12N_T1_MRCC_14) W21(IO_L7P_T1_D09_14) W22(IO_L7N_T1_D10_14) Y18(IO_L13P_T2_MRCC_14) Y19(IO_L13N_T2_MRCC_14) Y21(IO_L9P_T1_DQS_14) Y22(IO_L9N_T1_DQS_D13_14); U?#10 G13(IO_L1N_T0_AD0N_15) G15(IO_L2P_T0_AD8P_15) G16(IO_L2N_T0_AD8N_15) G17(IO_L4P_T0_15) G18(IO_L4N_T0_15) G20(IO_L8N_T1_AD10N_15) H13(IO_L1P_T0_AD0P_15) H14(IO_L3N_T0_DQS_AD1N_15) H15(IO_L5N_T0_AD9N_15) H17(IO_L6P_T0_15) H18(IO_L6N_T0_VREF_15) H19(IO_L12N_T1_MRCC_15) H20(IO_L8P_T1_AD10P_15) H22(IO_L7N_T1_AD2N_15) J14(IO_L3P_T0_DQS_AD1P_15) J15(IO_L5P_T0_AD9P_15) J16(IO_0_15) J17(IO_L21N_T3_DQS_A18_15) J19(IO_L12P_T1_MRCC_15) J20(IO_L11P_T1_SRCC_15) J21(IO_L11N_T1_SRCC_15) J22(IO_L7P_T1_AD2P_15) K13(IO_L19P_T3_A22_15) K14(IO_L19N_T3_A21_VREF_15) K16(IO_L23N_T3_FWE_B_15) K17(IO_L21P_T3_DQS_15) K18(IO_L13P_T2_MRCC_15) K19(IO_L13N_T2_MRCC_15) K21(IO_L9P_T1_DQS_AD3P_15) K22(IO_L9N_T1_DQS_AD3N_15) L13(IO_L20N_T3_A19_15) L14(IO_L22P_T3_A17_15) L15(IO_L22N_T3_A16_15) L16(IO_L23P_T3_FOE_B_15) L18(IO_L16N_T2_A27_15) L19(IO_L14P_T2_SRCC_15) L20(IO_L14N_T2_SRCC_15) L21(IO_L10N_T1_AD11N_15) M13(IO_L20P_T3_A20_15) M15(IO_L24P_T3_RS1_15) M16(IO_L24N_T3_RS0_15) M17(IO_25_15) M18(IO_L16P_T2_A28_15) M20(IO_L18N_T2_A23_15) M21(IO_L10P_T1_AD11P_15) M22(IO_L15N_T2_DQS_ADV_B_15) N18(IO_L17P_T2_A26_15) N19(IO_L17N_T2_A25_15) N20(IO_L18P_T2_A24_15) N22(IO_L15P_T2_DQS_15); U?#11 A13(IO_L10P_T1_16) A14(IO_L10N_T1_16) A15(IO_L9P_T1_DQS_16) A16(IO_L9N_T1_DQS_16) A18(IO_L17P_T2_16) A19(IO_L17N_T2_16) A20(IO_L16N_T2_16) A21(IO_L21N_T3_DQS_16) B13(IO_L8N_T1_16) B15(IO_L7P_T1_16) B16(IO_L7N_T1_16) B17(IO_L11P_T1_SRCC_16) B18(IO_L11N_T1_SRCC_16) B20(IO_L16P_T2_16) B21(IO_L21P_T3_DQS_16) B22(IO_L20N_T3_16) C13(IO_L8P_T1_16) C14(IO_L3P_T0_DQS_16) C15(IO_L3N_T0_DQS_16) C17(IO_L12N_T1_MRCC_16) C18(IO_L13P_T2_MRCC_16) C19(IO_L13N_T2_MRCC_16) C20(IO_L19N_T3_VREF_16) C22(IO_L20P_T3_16) D14(IO_L6P_T0_16) D15(IO_L6N_T0_VREF_16) D16(IO_L5N_T0_16) D17(IO_L12P_T1_MRCC_16) D19(IO_L14N_T2_SRCC_16) D20(IO_L19P_T3_16) D21(IO_L23N_T3_16) D22(IO_L22N_T3_16) E13(IO_L4P_T0_16) E14(IO_L4N_T0_16) E16(IO_L5P_T0_16) E17(IO_L2N_T0_16) E18(IO_L15N_T2_DQS_16) E19(IO_L14P_T2_SRCC_16) E21(IO_L23P_T3_16) E22(IO_L22P_T3_16) F13(IO_L1P_T0_16) F14(IO_L1N_T0_16) F15(IO_0_16) F16(IO_L2P_T0_16) F18(IO_L15P_T2_DQS_16) F19(IO_L18P_T2_16) F20(IO_L18N_T2_16) F21(IO_25_16) G21(IO_L24P_T3_16) G22(IO_L24N_T3_16)

### Notes on the sheet
- Перв.примен.
- Справ.№
- Подп. и дата
- Инв.№ дубл.
- Взам.инв.№
- Подп.и дата
- Разраб.
- Изм.
- Лист
- № докум.
- Подп.
- Дата
- Лит.
- Масштаб
- Масса
- Т.контр.
- Пров.
- СХЕМА   ЭЛЕКТРИЧЕСКАЯ
- ПРИНЦИПИАЛЬНАЯ
- Листов
- Инв.№ подл.
- Утв.
- Н.контр.
- Нач.сект.
- Формат  A3
- (in symbol ASV-50.000MHZ-LRS-T) 50 MHz
- (in symbol XC7A50T-2FGG484I, part B) BANK 14
- (in symbol XC7A50T-2FGG484I, part C) BANK 15
- (in symbol XC7A50T-2FGG484I, part D) BANK 16
- (in symbol XC7A50T-2FGG484I, part E) BANK 34
- (in symbol XC7A50T-2FGG484I, part F) BANK 35

### Library data of the parts
G?#2 = ASV-50.000MHZ-LRS-T: as G?#1 on sheet 02_FPGA_IO_Config; Datasheet Link: https://abracon.com/Oscillators/ASV.pdf; Height: 1.8mm; Manufacturer_Part_Number: ASV-50.000MHZ-LRS-T; Mouser Part Number: 815-ASV50000MHZLRST; Mouser Price/Stock: https://www.mouser.co.uk/ProductDetail/ABRACON/ASV-50.000MHZ-LRS-T?qs=vmHwEFxEFR%252BcE99Zr2GZkQ%3D%3D
R?#9 = Резистор RC0805FR-071KL (1 кОм +-1%): Resistance: 1k; Tolerance: ±1%; Power: 0.125 W; Maximum Working Voltage: 150V; Maximum Overload Voltage: 300V; Part Number: Резистор RC0805FR-071KL (1 кОм +-1%); HelpURL: http://www.yageo.ru/pdf/RC0805.pdf
U?#7-U?#11 = XC7A50T-2FGG484I: as U?#1 on sheet 01_Power; Manufacturer_Part_Number: XC7A50T-2FGG484I; Mouser Part Number: 217-XC7A50T-2FGG484I; Mouser Price/Stock: https://www.mouser.co.uk/ProductDetail/Xilinx/XC7A50T-2FGG484I?qs=rrS6PyfT74djoRso%252BOe%2F9Q%3D%3D; Arrow Part Number: *; Arrow Price/Stock: *; Datasheet Link: https://www.xilinx.com/support/documentation/data_sheets/ds181_Artix_7_Data_Sheet.pdf

## Sheet 04_Reference_Inputs.SchDoc: Наименование
size 420 x 297 mm; Name: Наименование; ApprovedBy: Сергеева А.А.; CheckedBy: Рогозин А.А.; Author: Кузнецов М.Д.; CompanyName: МГТУ им. Баумана; DocumentNumber: 5; SheetNumber: 5; SheetTotal: 7; PageSetup: Record=PageOptions|CenterHorizontal=True|CenterVertical=True|PrintScale=0.94|XCorrection=1.00|YCorrection=1.00|PrintKind=1|BorderSize=5000000|LeftOffset=0|BottomOffset=0|Orientation=1|PaperLength=1000|PaperWidth=1000|Scale=100|PaperSource=7|PrintQuality=-4|MediaType=1|DitherType=10|PaperKind=A4|PrintScaleMode=1; DecimalNumber: МГТУ.468784.001; HeadOfSector: Нач. сектора; MainDevice: Перв.примен.; Name1: Плата расширения; n_kontr: Н. Контр; t_kontr: Т. Контр; lit_A: О; Name2: для отладочного модуля; DocumentName: Sheet1.SCHDOC

### Notes on the sheet
- Перв.примен.
- Справ.№
- Подп. и дата
- Инв.№ дубл.
- Взам.инв.№
- Подп.и дата
- Разраб.
- Изм.
- Лист
- № докум.
- Подп.
- Дата
- Лит.
- Масштаб
- Масса
- Т.контр.
- Пров.
- СХЕМА   ЭЛЕКТРИЧЕСКАЯ
- ПРИНЦИПИАЛЬНАЯ
- Листов
- Инв.№ подл.
- Утв.
- Н.контр.
- Нач.сект.
- Формат  A3

## Sheet 05_PPS_Outputs.SchDoc: Наименование
size 420 x 297 mm; Name: Наименование; ApprovedBy: Сергеева А.А.; CheckedBy: Рогозин А.А.; Author: Кузнецов М.Д.; CompanyName: МГТУ им. Баумана; DocumentNumber: 6; SheetNumber: 6; SheetTotal: 7; PageSetup: Record=PageOptions|CenterHorizontal=True|CenterVertical=True|PrintScale=0.94|XCorrection=1.00|YCorrection=1.00|PrintKind=1|BorderSize=5000000|LeftOffset=0|BottomOffset=0|Orientation=1|PaperLength=1000|PaperWidth=1000|Scale=100|PaperSource=7|PrintQuality=-4|MediaType=1|DitherType=10|PaperKind=A4|PrintScaleMode=1; DecimalNumber: МГТУ.468784.001; HeadOfSector: Нач. сектора; MainDevice: Перв.примен.; Name1: Плата расширения; n_kontr: Н. Контр; t_kontr: Т. Контр; lit_A: О; Name2: для отладочного модуля; DocumentName: Sheet1.SCHDOC

### Notes on the sheet
- Перв.примен.
- Справ.№
- Подп. и дата
- Инв.№ дубл.
- Взам.инв.№
- Подп.и дата
- Разраб.
- Изм.
- Лист
- № докум.
- Подп.
- Дата
- Лит.
- Масштаб
- Масса
- Т.контр.
- Пров.
- СХЕМА   ЭЛЕКТРИЧЕСКАЯ
- ПРИНЦИПИАЛЬНАЯ
- Листов
- Инв.№ подл.
- Утв.
- Н.контр.
- Нач.сект.
- Формат  A3

## Sheet 06_Ethernet.SchDoc: Наименование
size 420 x 297 mm; Name: Наименование; ApprovedBy: Сергеева А.А.; CheckedBy: Рогозин А.А.; Author: Кузнецов М.Д.; CompanyName: МГТУ им. Баумана; DocumentNumber: 7; SheetNumber: 6; SheetTotal: 6; PageSetup: Record=PageOptions|CenterHorizontal=True|CenterVertical=True|PrintScale=0.94|XCorrection=1.00|YCorrection=1.00|PrintKind=1|BorderSize=5000000|LeftOffset=0|BottomOffset=0|Orientation=1|PaperLength=1000|PaperWidth=1000|Scale=100|PaperSource=7|PrintQuality=-4|MediaType=1|DitherType=10|PaperKind=A4|PrintScaleMode=1; DecimalNumber: МГТУ.468784.001; HeadOfSector: Нач. сектора; MainDevice: Перв.примен.; Name1: Плата расширения; n_kontr: Н. Контр; t_kontr: Т. Контр; lit_A: О; Name2: для отладочного модуля; DocumentName: Sheet1.SCHDOC
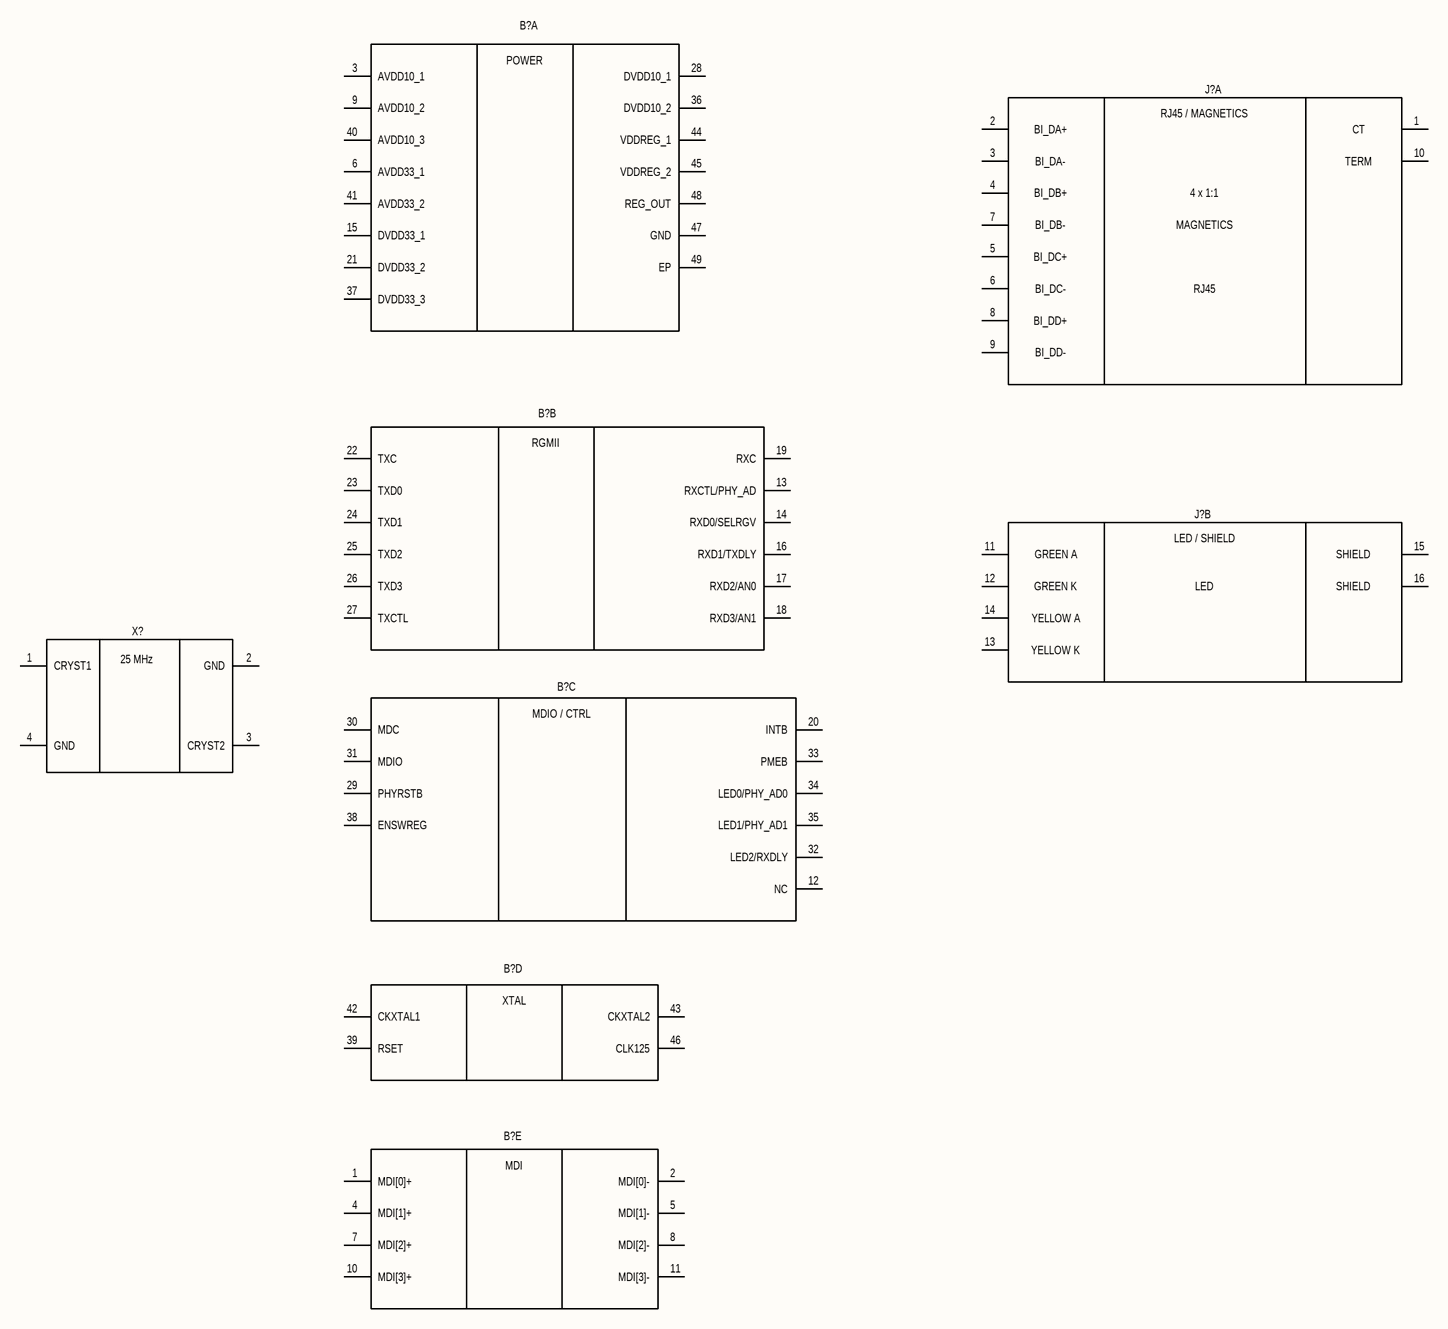
[diagram p3: 06_Ethernet.SchDoc]

### Parts
(Parts that share a designator on the sheet are numbered #1, #2 ... from top to bottom, then left to right.)
B?#2  RTL8211E-VB-CG  [QFN40P600X600X100-49N]  (value not drawn)  (part A of 5)
B?#3  RTL8211E-VB-CG  [QFN40P600X600X100-49N]  (value not drawn)  (part B of 5)
B?#4  RTL8211E-VB-CG  [QFN40P600X600X100-49N]  (value not drawn)  (part C of 5)
B?#5  RTL8211E-VB-CG  [QFN40P600X600X100-49N]  (value not drawn)  (part D of 5)
B?#6  RTL8211E-VB-CG  [QFN40P600X600X100-49N]  (value not drawn)  (part E of 5)
J?#1  HR911130A  [HR911130A]  (value not drawn)  (part A of 2)
J?#2  HR911130A  [HR911130A]  (value not drawn)  (part B of 2)
X?  HKC3225SX-25MHZ-26594-R4V1  [HKC3225SX25MHZ26594R4V1]  (value not drawn)

### Nets

Not connected (* = marked no-connect by the designer): B?#2 3(AVDD10_1) 6(AVDD33_1) 9(AVDD10_2) 15(DVDD33_1) 21(DVDD33_2) 28(DVDD10_1) 36(DVDD10_2) 37(DVDD33_3) 40(AVDD10_3) 41(AVDD33_2) 44(VDDREG_1) 45(VDDREG_2) 47(GND) 48(REG_OUT) 49(EP); B?#3 13(RXCTL/PHY_AD) 14(RXD0/SELRGV) 16(RXD1/TXDLY) 17(RXD2/AN0) 18(RXD3/AN1) 19(RXC) 22(TXC) 23(TXD0) 24(TXD1) 25(TXD2) 26(TXD3) 27(TXCTL); B?#4 12(NC) 20(INTB) 29(PHYRSTB) 30(MDC) 31(MDIO) 32(LED2/RXDLY) 33(PMEB) 34(LED0/PHY_AD0) 35(LED1/PHY_AD1) 38(ENSWREG); B?#5 39(RSET) 42(CKXTAL1) 43(CKXTAL2) 46(CLK125); B?#6 1(MDI[0]+) 2(MDI[0]-) 4(MDI[1]+) 5(MDI[1]-) 7(MDI[2]+) 8(MDI[2]-) 10(MDI[3]+) 11(MDI[3]-); J?#1 1 2 3 4 5 6 7 8 9 10; J?#2 11 12 13 14 15 16; X? 1(CRYST1) 2(GND) 3(CRYST2) 4(GND)

### Notes on the sheet
- Перв.примен.
- Справ.№
- Подп. и дата
- Инв.№ дубл.
- Взам.инв.№
- Подп.и дата
- Разраб.
- Изм.
- Лист
- № докум.
- Подп.
- Дата
- Лит.
- Масштаб
- Масса
- Т.контр.
- Пров.
- СХЕМА   ЭЛЕКТРИЧЕСКАЯ
- ПРИНЦИПИАЛЬНАЯ
- Листов
- Инв.№ подл.
- Утв.
- Н.контр.
- Нач.сект.
- Формат  A3
- (in symbol HKC3225SX-25MHZ-26594-R4V1) 25 MHz
- (in symbol HR911130A, part A) RJ45 / MAGNETICS; BI_DA+; CT; BI_DA-; TERM; BI_DB+; 4 x 1:1; BI_DB-; MAGNETICS; BI_DC+; BI_DC-; RJ45; BI_DD+; BI_DD-
- (in symbol HR911130A, part B) LED / SHIELD; GREEN A; SHIELD; GREEN K; LED; YELLOW A; YELLOW K
- (in symbol RTL8211E-VB-CG, part A) POWER
- (in symbol RTL8211E-VB-CG, part B) RGMII
- (in symbol RTL8211E-VB-CG, part C) MDIO / CTRL
- (in symbol RTL8211E-VB-CG, part D) XTAL
- (in symbol RTL8211E-VB-CG, part E) MDI

### Library data of the parts
B?#2-B?#6 = RTL8211E-VB-CG: h; Manufacturer_Name: Realtek; Geometry.Height: 1mm; Manufacturer_Part_Number: RTL8211E-VB-CG; Mouser Part Number: *; Mouser Price/Stock: *; Arrow Part Number: *; Arrow Price/Stock: *; Datasheet Link: http://download3.dvd-driver.cz/realtek/datasheets/pdf/rtl8211e(g)-vb(vl)-cg_datasheet_1.6.pdf
J?#1 J?#2 = HR911130A: SINGLE PORT RJ45 CONNECTOR WITH INTEGRATED MAGNETICS AND LED; Manufacturer_Name: Hanrun Electronics; Geometry.Height: 13mm; Manufacturer_Part_Number: HR911130A; Mouser Part Number: *; Mouser Price/Stock: *; Arrow Part Number: *; Arrow Price/Stock: *; Datasheet Link: https://datasheet.lcsc.com/szlcsc/Zhongshan-HanRun-Elec-HR911130A_C54408.pdf
X? = HKC3225SX-25MHZ-26594-R4V1: 3225 Ceramic SMD Crystals, 25 MHz; Manufacturer_Name: Hong Kong XвЂ™tals Limited; Geometry.Height: 0.8mm; Manufacturer_Part_Number: HKC3225SX-25MHZ-26594-R4V1; Mouser Part Number: *; Mouser Price/Stock: *; Arrow Part Number: *; Arrow Price/Stock: *; Datasheet Link: https://cms.nacsemi.com/content/AuthDatasheets/HKCrystal/C7.pdf

## Nets that join several sheets
3V3: 02_FPGA_IO_Config (7 pins), 03_FPGA_IO_Clock (R?#9.2)
QSPI_DQ0: 02_FPGA_IO_Config (U?#5.5), 03_FPGA_IO_Clock (U?#9.P22)
QSPI_DQ1: 02_FPGA_IO_Config (U?#5.2), 03_FPGA_IO_Clock (U?#9.R22)
QSPI_DQ2: 02_FPGA_IO_Config (R?#3.2 U?#5.3), 03_FPGA_IO_Clock (U?#9.P21)
QSPI_DQ3: 02_FPGA_IO_Config (R?#5.2 U?#5.7), 03_FPGA_IO_Clock (U?#9.R21)